# EAGLE design MCU_v1 (EAGLE 7.6.0)
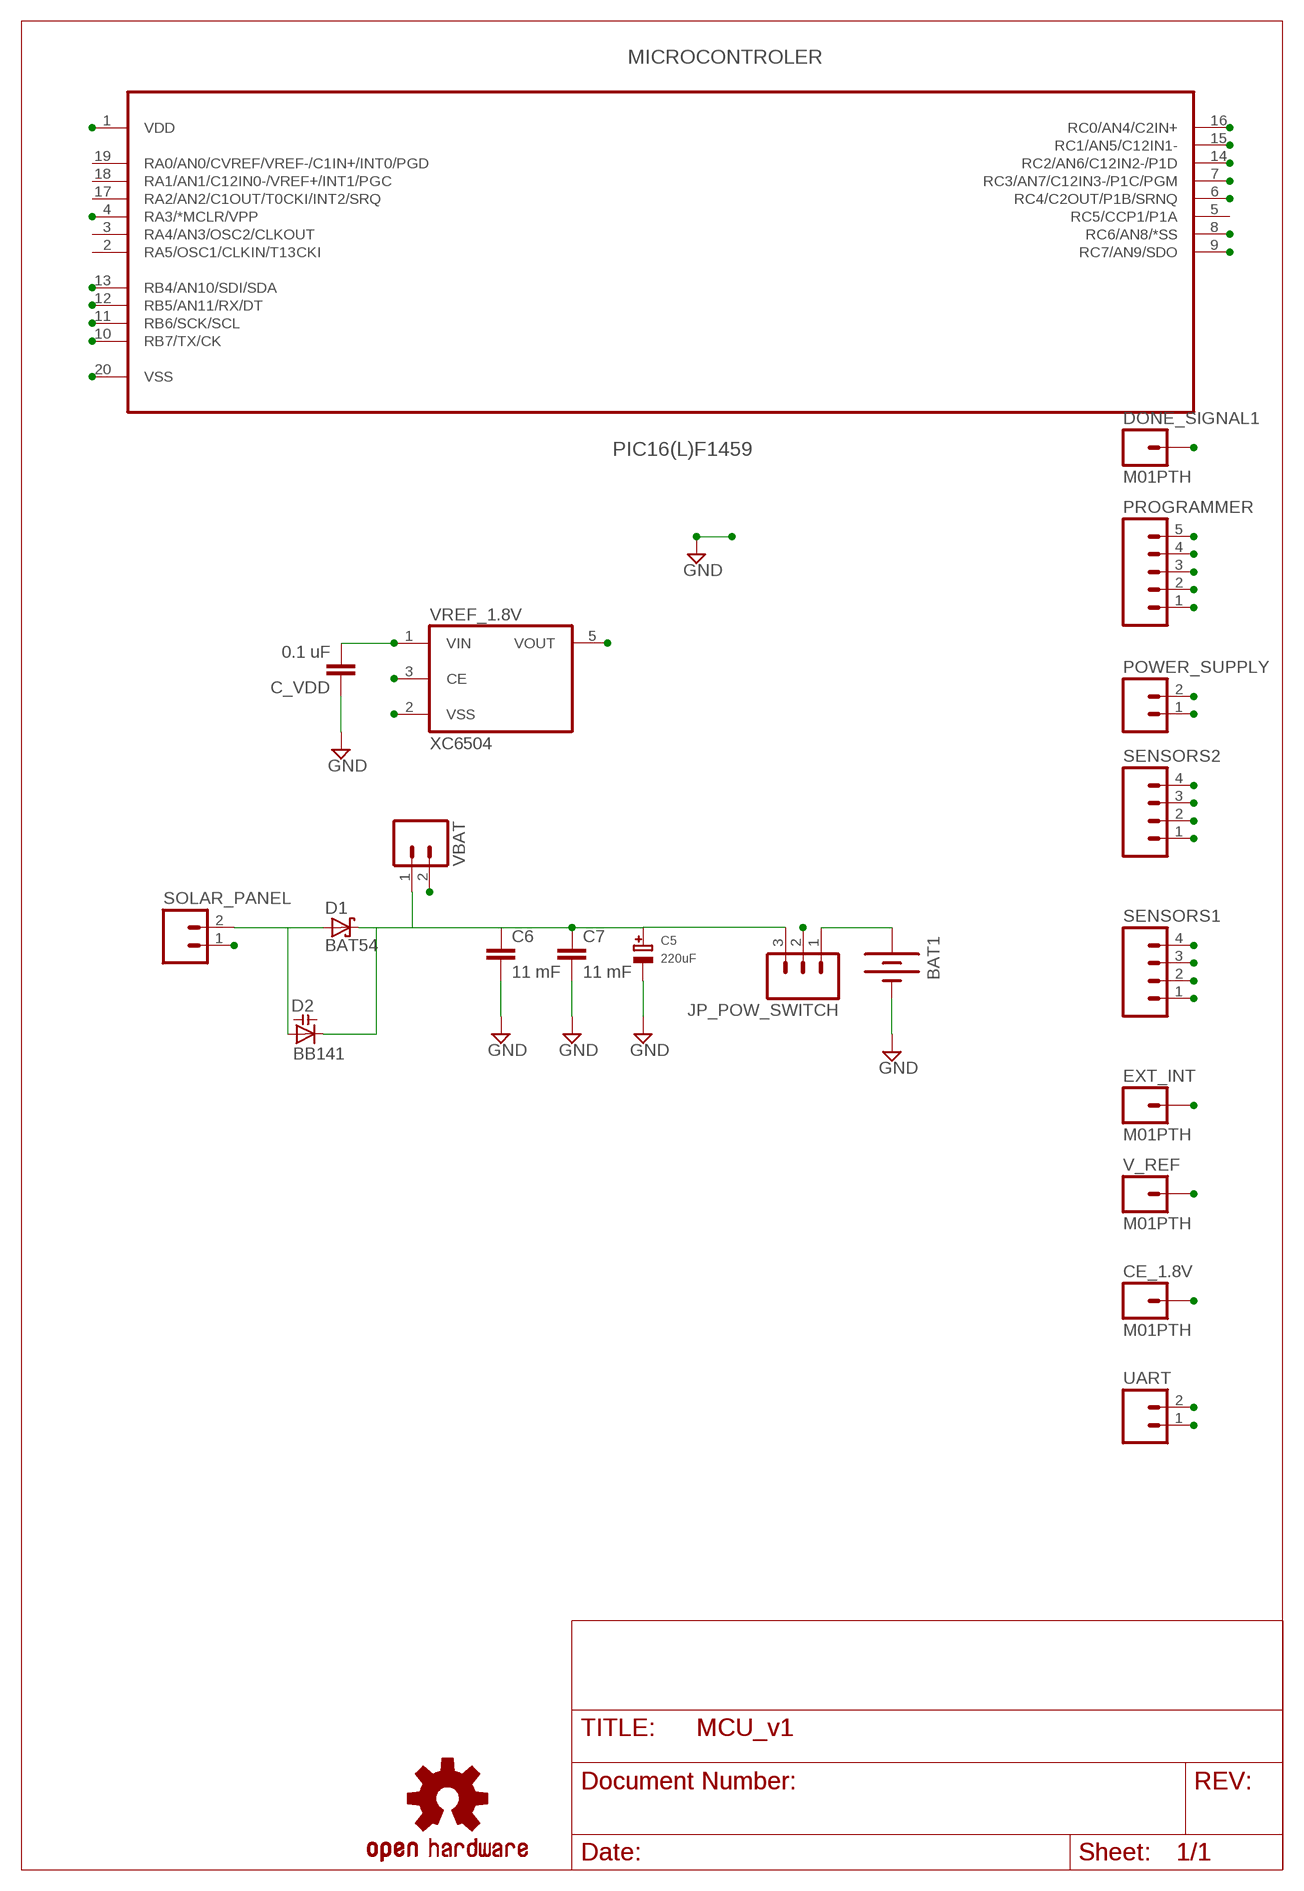
[diagram p0: schematic, sheet 1]

## Parts
BAT1  BATTERY20PTH_LAB  [BATTCOM_20MM_PTH]
C5  220uF  CAP_TANTALUMD/7343_REFLOW  [EIA7343-31/D-R]
C6  11 mF  CAP1210  [1210]
C7  11 mF  CAP1210  [1210]
C_VDD  0.1 uF  CAP0603-CAP  [0603-CAP]
CE_1.8V  M01PTH  [1X01]
D1  BAT54  [SOT23]
D2  BB141  [SOD523]
DONE_SIGNAL1  M01PTH  [1X01]
EXT_INT  M01PTH  [1X01]
JP_POW_SWITCH  M03LOCK  [1X03_LOCK]
LOGO1  OSHW-LOGOL  [OSHW-LOGO-L]
MICROCONTROLER  PIC16(L)F1459  PIC18F13K22-I/SS  [SOP65P780X200-20N]
POWER_SUPPLY  M02PTH  [1X02]
PROGRAMMER  M05PTH  [1X05]
SENSORS1  M04LOCK  [1X04_LOCK]
SENSORS2  M04LOCK  [1X04_LOCK]
SOLAR_PANEL  M02PTH  [1X02]
UART  M02PTH  [1X02]
V_REF  M01PTH  [1X01]
VBAT  M02PTH  [1X02]
VREF_1.8V  XC6504  XC6220MR  [SOT23-5]

## Nets
CE: CE_1.8V.1 VREF_1.8V.3(CE)
DAC1: MICROCONTROLER.14(RC2/AN6/C12IN2-/P1D) SENSORS2.4
DEL: C5.+ C6.1 C7.1 D1.3(C) D2.C JP_POW_SWITCH.3 VBAT.1
DONE_OUT: DONE_SIGNAL1.1 MICROCONTROLER.7(RC3/AN7/C12IN3-/P1C/PGM)
GND: BAT1.2(-) C5.- C6.2 C7.2 C_VDD.1 MICROCONTROLER.20(VSS) POWER_SUPPLY.1 PROGRAMMER.3 SENSORS1.1 SENSORS1.3 SOLAR_PANEL.1 UART.2 VBAT.2 VREF_1.8V.2(VSS)
MCLR: MICROCONTROLER.4(RA3/*MCLR/VPP) PROGRAMMER.5
N$6: BAT1.1(+) JP_POW_SWITCH.1
RB4: MICROCONTROLER.13(RB4/AN10/SDI/SDA) SENSORS2.3
RB5: MICROCONTROLER.12(RB5/AN11/RX/DT) SENSORS2.2
RB6: MICROCONTROLER.11(RB6/SCK/SCL) SENSORS2.1
SENSOR1: MICROCONTROLER.8(RC6/AN8/*SS) SENSORS1.4
SENSOR2: MICROCONTROLER.9(RC7/AN9/SDO) SENSORS1.2
SOLAR_CELL: D1.1(A) D2.A SOLAR_PANEL.2
SPCLK: EXT_INT.1 MICROCONTROLER.15(RC1/AN5/C12IN1-) PROGRAMMER.1
SPDAT: MICROCONTROLER.16(RC0/AN4/C2IN+) PROGRAMMER.2 V_REF.1
SWITCH_CTTL: MICROCONTROLER.6(RC4/C2OUT/P1B/SRNQ)
UART_TX: MICROCONTROLER.10(RB7/TX/CK) UART.1
VDD: C_VDD.2 JP_POW_SWITCH.2 VREF_1.8V.1(VIN)
VDD_1.8V: MICROCONTROLER.1(VDD) POWER_SUPPLY.2 PROGRAMMER.4 VREF_1.8V.5(VOUT)
Unconnected: MICROCONTROLER.2(RA5/OSC1/CLKIN/T13CKI) MICROCONTROLER.3(RA4/AN3/OSC2/CLKOUT) MICROCONTROLER.5(RC5/CCP1/P1A) MICROCONTROLER.17(RA2/AN2/C1OUT/T0CKI/INT2/SRQ) MICROCONTROLER.18(RA1/AN1/C12IN0-/VREF+/INT1/PGC) MICROCONTROLER.19(RA0/AN0/CVREF/VREF-/C1IN+/INT0/PGD)

## Library data of the parts
BAT1 = semipassiveTag_library:BATTERY: Battery Holders Various common sizes : AA, AAA, 20mm coin cell and 12mm coin cell.
C5 = microbuilder:CAP_TANTALUM: Tantalum Capacitors Wave footprints have larger pads and are meant to be used for hand soldering. Reflow footprints are optimised for solder paste and a reflow oven. EIA3216-18/A-[R/W] - Size A / 3216-18 / 1206 footprint 4.7µF 25V 10% Tantalum Capacitor 10µF 16V 10% Tantalum Capacitor [Digikey: 495-2236-2-ND] EIA3528-21/B-[R/W] - Size B / 3528-21 47µF 10V 10% Tantalum Capactior [Digikey: 495-2216-1-ND] EIA6032-28/C-[R/W] - Size C / 6032-28 10µF 35V 20% Tantalum Capacitor [Digikey: 495-2285-1-ND] 100µF 16V 10% Tantalum Capactior [Digikey: 399-5214-1-ND]
C6 C7 = SparkFun:CAP: Capacitor Standard 0603 ceramic capacitor, and 0.1" leaded capacitor.
C_VDD = SparkFun-Capacitors:CAP: Capacitor Standard 0603 ceramic capacitor, and 0.1" leaded capacitor.
CE_1.8V DONE_SIGNAL1 EXT_INT V_REF = SparkFun:M01: Header 1 Standard 1-pin 0.1" header. Use with straight break away headers (SKU : PRT-00116), right angle break away headers (PRT-00553), swiss pins (PRT-00743), machine pins (PRT-00117), and female headers (PRT-00115).
D1 = diode:BAT54: Schottky Diodes Source: Fairchild .. BAT54.pdf
D2 = diode:BB141: Capacity DIODE variable-capacitance diode
JP_POW_SWITCH = SparkFun-Connectors:M03: Header 3 Standard 3-pin 0.1" header. Use with straight break away headers (SKU : PRT-00116), right angle break away headers (PRT-00553), swiss pins (PRT-00743), machine pins (PRT-00117), and female headers (PRT-00115). Molex polarized connector foot print use with SKU : PRT-08232 with associated crimp pins and housings.
LOGO1 = SparkFun-Aesthetics:OSHW-LOGO: Open Source Hardware Logo This logo indicates the piece of hardware it is found on incorporates a OSHW license and/or adheres to the definition of open source hardware found here: http://freedomdefined.org/OSHW
MICROCONTROLER = Microchip_By_element14_Batch_1:PIC18F13K22-I/SS: Flash Microcontrollers; MPN: PIC18F13k22-I/SS; OC_FARNELL: 1778460; OC_NEWARK: 07P9666; PACKAGE: SSOP-20; SUPPLIER: Microchip
POWER_SUPPLY SOLAR_PANEL UART VBAT = SparkFun:M02: Header 2 Standard 2-pin 0.1" header. Use with straight break away headers (SKU : PRT-00116), right angle break away headers (PRT-00553), swiss pins (PRT-00743), machine pins (PRT-00117), and female headers (PRT-00115). Molex polarized connector foot print use with SKU : PRT-08233 with associated crimp pins and housings.
PROGRAMMER = SparkFun:M05: Header 5 Standard 5-pin 0.1" header. Use with straight break away headers (SKU : PRT-00116), right angle break away headers (PRT-00553), swiss pins (PRT-00743), machine pins (PRT-00117), and female headers (PRT-00115). Molex polarized connector foot print use with SKU : PRT-08230 with associated crimp pins and housings.
SENSORS1 SENSORS2 = SparkFun:M04: Header 4 Standard 4-pin 0.1" header. Use with straight break away headers (SKU : PRT-00116), right angle break away headers (PRT-00553), swiss pins (PRT-00743), machine pins (PRT-00117), and female headers (PRT-00115). Molex polarized connector foot print use with SKU : PRT-08231 with associated crimp pins and housings. 1MM SMD Version SKU: PRT-10208
VREF_1.8V = torex:XC6220: LDO Regulator 1A

## Board
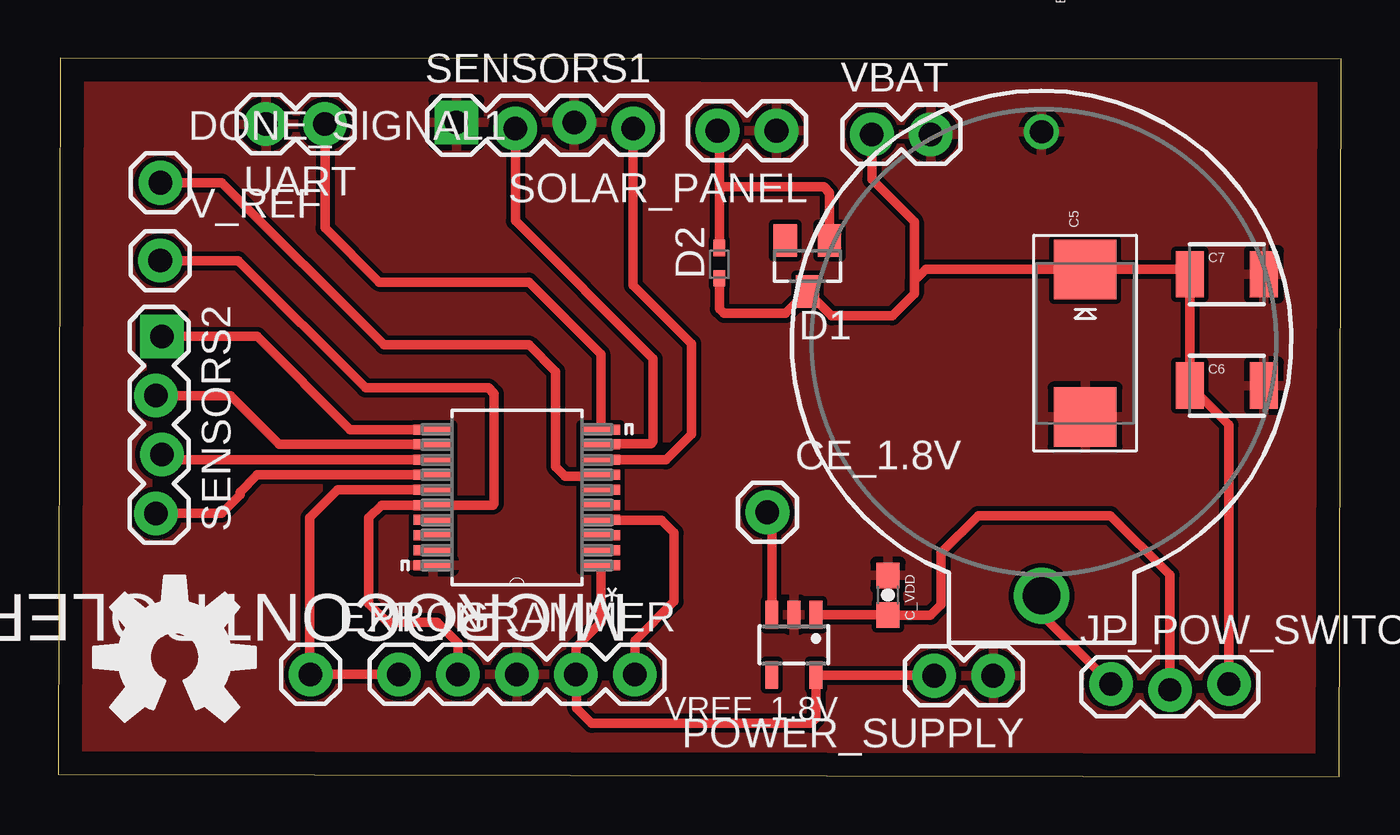
[diagram p1: board, top side]

Size 55.29 x 30.95 mm. Coordinates in mm from the lower left corner, seen from the top.
Outline: 0,0.1 55.2,0 55.29,30.9 0.09,30.95 0,0.1
Copper layers (1*16): Top 0.035mm / dielectric 1.5mm / Bottom 0.035mm
Design rules "default": minimum track width 10mil, minimum drill 24mil, track to track 8mil, track to pad 8mil, pad to pad 8mil, via to via 8mil, smd to smd 8mil, copper to edge 40mil, drill to drill 8mil, minimum pad ring 10mil, minimum via ring 8mil, stop-mask expansion 4mil, vias tented up to drill 0mil, thermal gap 10mil

### Footprints (pad centres in the part's own frame; a part is rotated, then mirrored left to right if it is on the bottom)
BATTCOM_20MM_PTH = drill 1.6: 1 19.99,0 | drill 1: 2 0,0
EIA7343-31/D-R = smd 2.55 x 2.7: + 3.175,0; - -3.175,0
1210 = smd 1.2 x 2: 1 -1.6,0; 2 1.6,0
0603-CAP = smd 1.1 x 1: 1 -0.85,0; 2 0.85,0
1X01 = drill 1.016 pad 1.88: 1 0,0
SOT23 = smd 1 x 1.4: 1 -0.95,-1.1; 2 0.95,-1.1; 3 0,1.1
SOD523 = smd 0.7 x 0.5: A 0.7,0; C -0.6,0
1X03_LOCK = drill 1 pad 1.88: 1 0,0.127; 2 2.54,-0.127; 3 5.08,0.127
SOP65P780X200-20N = smd 1.676 x 0.432: 1 -3.607,2.921; 2 -3.607,2.286; 3 -3.607,1.626; 4 -3.607,0.965; 5 -3.607,0.33; 6 -3.607,-0.33; 7 -3.607,-0.965; 8 -3.607,-1.626; 9 -3.607,-2.286; 10 -3.607,-2.921; 11 3.607,-2.921; 12 3.607,-2.286; 13 3.607,-1.626; 14 3.607,-0.965; 15 3.607,-0.33; 16 3.607,0.33; 17 3.607,0.965; 18 3.607,1.626; 19 3.607,2.286; 20 3.607,2.921
1X02 = drill 1.016 pad 1.88: 1 0,0; 2 2.54,0
1X05 = drill 1.016 pad 1.88: 1 0,0; 2 2.54,0; 3 5.08,0; 4 7.62,0; 5 10.16,0
1X04_LOCK = drill 1.016 pad 1.88 square: 1 0,0.127 | drill 1.016 pad 1.88: 2 2.54,-0.127; 3 5.08,0.127; 4 7.62,-0.127
SOT23-5 = smd 0.55 x 1.2: 1 -0.95,-1.3; 2 0,-1.3; 3 0.95,-1.3; 4 0.95,1.3; 5 -0.95,1.3

### Placement (x,y rotation side)
BAT1  42.37,27.78 270 top
C5  44.25,18.67 90 top
C6  50.35,16.84 0 top
C7  50.35,21.64 0 top
C_VDD  35.75,7.82 270 top
CE_1.8V  30.56,11.39 0 top
D1  32.28,21.99 180 top
D2  28.49,22.07 90 top
DONE_SIGNAL1  4.41,25.58 0 top
EXT_INT  10.88,4.41 0 top
JP_POW_SWITCH  45.36,3.87 0 top
LOGO1  5.02,5.15 0 top
MICROCONTROLER  19.77,12.03 180 top
POWER_SUPPLY  40.29,4.35 180 top
PROGRAMMER  14.69,4.41 0 top
SENSORS1  17.16,28.05 0 top
SENSORS2  4.35,18.96 270 top
SOLAR_PANEL  30.95,27.82 180 top
UART  11.5,28.11 180 top
V_REF  4.4,22.23 0 top
VBAT  35.06,27.66 0 top
VREF_1.8V  31.7,5.68 180 top

### Tracks (layer width: path | path; a pad name or v marks a point on that pad's centre or on a via)
CE
  Top 0.406: VREF_1.8V.3 30.75,11.2 CE_1.8V.1
DAC1
  Top 0.406: MICROCONTROLER.14 8.59,12.99 7.84,12.25 7.84,12.15 7.04,11.35 4.23,11.35 SENSORS2.4
DEL
  Top 0.406: D2.C 28.49,20.15 28.69,19.95 31.34,19.95 D1.3 33.32,19.85 35.94,19.85 36.89,20.8 36.89,21.35 | VBAT.1 35.06,25.73 36.89,23.9 36.89,21.35 | 36.89,21.35 37.39,21.85 C5.+ 48.55,21.85 C7.1 C6.1 50.44,15.15 JP_POW_SWITCH.3
DONE_OUT
  Top 0.406: DONE_SIGNAL1.1 7.06,25.58 14.04,18.6 20.29,18.6 21.44,17.45 21.44,13.35 21.84,12.95 23.33,12.95 MICROCONTROLER.7
GND
  pour Top: -27.22,81.88 -27.22,-1.94 80.73,-1.94 80.73,84.42 -27.22,84.42
MCLR
  Top 0.406: PROGRAMMER.5 24.85,5.86 26.54,7.55 26.54,10.5 25.99,11.05 23.39,11.05 MICROCONTROLER.4
N$6
  Top 0.406: BAT1.1 42.37,6.99 JP_POW_SWITCH.1
RB4
  Top 0.406: MICROCONTROLER.13 4.7,13.66 SENSORS2.3
RB5
  Top 0.406: MICROCONTROLER.12 9.52,14.32 7.44,16.4 4.24,16.4 SENSORS2.2
RB6
  Top 0.406: SENSORS2.1 8.58,18.96 12.59,14.95 MICROCONTROLER.11
SENSOR1
  Top 0.406: SENSORS1.4 24.78,21.16 27.29,18.65 27.29,14.75 26.19,13.65 MICROCONTROLER.8
SENSOR2
  Top 0.406: SENSORS1.2 19.7,23.94 25.64,18 25.64,14.45 25.54,14.35 23.41,14.35 MICROCONTROLER.9
SOLAR_CELL
  Top 0.406: D2.A 28.49,25.5 | 28.49,25.5 28.49,27.74 SOLAR_PANEL.2 | D1.1 33.23,25.16 32.99,25.4 28.59,25.4 28.49,25.5
SPCLK
  Top 0.406: PROGRAMMER.1 EXT_INT.1 10.84,4.45 10.84,11.15 12.05,12.36 MICROCONTROLER.15
SPDAT
  Top 0.406: MICROCONTROLER.16 13.94,11.7 13.39,11.15 13.39,7.45 14.19,6.65 16.34,6.65 17.24,5.75 PROGRAMMER.2 | V_REF.1 7.76,22.23 13.24,16.75 18.54,16.75 18.79,16.5 18.79,11.75 18.74,11.7 MICROCONTROLER.16 | MICROCONTROLER.16
UART_TX
  Top 0.406: UART.1 11.5,23.64 13.84,21.3 20.29,21.3 23.39,18.2 23.39,14.96 MICROCONTROLER.10
VDD
  Top 0.406: VREF_1.8V.1 C_VDD.2 35.77,6.95 37.59,6.95 38.04,7.4 38.04,9.65 39.64,11.25 45.34,11.25 47.9,8.69 JP_POW_SWITCH.2
VDD_1.8V
  Top 0.406: MICROCONTROLER.1 23.39,9.1 23.39,6.65 22.31,5.57 PROGRAMMER.4 22.34,4.38 22.34,2.95 22.99,2.3 32.44,2.3 32.65,2.51 VREF_1.8V.5 37.72,4.38 POWER_SUPPLY.2